# EAGLE design CC2530 (EAGLE 7.1.0)
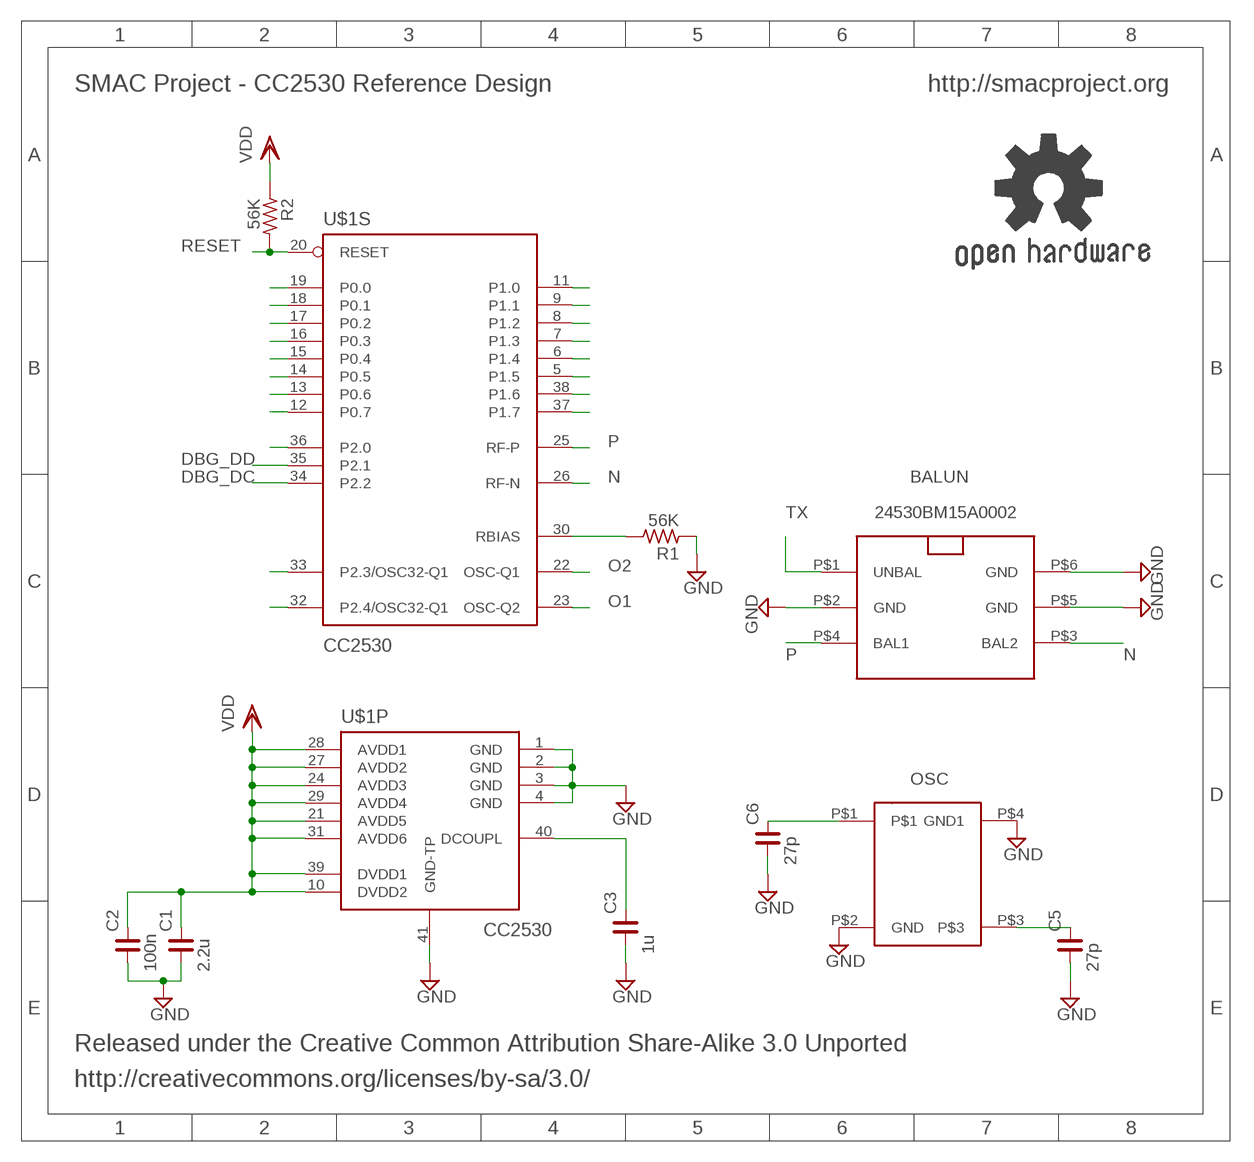
[diagram p0: schematic, sheet 1]

## Parts
C1  2.2u  C_0402  [C0402]
C2  100n  C_0402  [C0402]
C3  1u  C_0402  [C0402]
C5  27p  C_0402  [C0402]
C6  27p  C_0402  [C0402]
GOLD_ORB_SM2  OSHWLOGO_REF_SM  [OSHW2REF]
R1  56K  R_0402  [R0402]
R2  56K  R_0402  [R0402]
U$1  CC2530  [QFN50P600X600X100-41N]
U$2  24530BM15A0002  [24530BM15A0002]
U$3  ABM_10  [ABM_OSC]

## Nets
DBG_DC: U$1.34(P2.2)
DBG_DD: U$1.35(P2.1)
GND: C1.1 C2.1 C3.1 C5.1 C6.1 R1.1 U$1.1(GND) U$1.2(GND) U$1.3(GND) U$1.4(GND) U$1.41(GND-TP) U$2.P$2(GND) U$2.P$5(GND) U$2.P$6(GND) U$3.P$2(GND) U$3.P$4(GND1)
N: U$1.26(RF-N) U$2.P$3(BAL2)
N$1: C3.2 U$1.40(DCOUPL)
N$2: U$1.33(P2.3/OSC32-Q1)
N$3: U$1.11(P1.0)
N$4: U$1.9(P1.1)
N$5: R1.2 U$1.30(RBIAS)
N$6: U$1.37(P1.7)
N$7: U$1.38(P1.6)
N$8: U$1.5(P1.5)
N$9: U$1.8(P1.2)
N$10: U$1.7(P1.3)
N$11: U$1.6(P1.4)
N$12: U$1.13(P0.6)
N$13: U$1.12(P0.7)
N$14: U$1.16(P0.3)
N$15: U$1.17(P0.2)
N$16: U$1.36(P2.0)
N$17: U$1.14(P0.5)
N$18: U$1.15(P0.4)
N$19: U$1.18(P0.1)
N$20: U$1.19(P0.0)
N$21: U$1.32(P2.4/OSC32-Q1)
O1: C6.2 U$1.23(OSC-Q2) U$3.P$1
O2: C5.2 U$1.22(OSC-Q1) U$3.P$3
P: U$1.25(RF-P) U$2.P$4(BAL1)
RESET: R2.2 U$1.20(RESET)
TX: U$2.P$1(UNBAL)
VDD: C1.2 C2.2 R2.1 U$1.10(DVDD2) U$1.21(AVDD5) U$1.24(AVDD3) U$1.27(AVDD2) U$1.28(AVDD1) U$1.29(AVDD4) U$1.31(AVDD6) U$1.39(DVDD1)

## Notes on the sheet
- SMAC Project - CC2530 Reference Design | http://smacproject.org
- BALUN
- OSC
- Released under the Creative Common Attribution Share-Alike 3.0 Unported
- http://creativecommons.org/licenses/by-sa/3.0/

## Library data of the parts
C1-C3 C5 C6 = rc-master-smd:C_: NON-POLARIZED CAP
GOLD_ORB_SM2 = bfl:OSHWLOGO: These are Open-Source Hardware logos.
R1 R2 = rc-master-smd:R_: RESISTOR
U$1 = chipcon-ti-v2:CC2530: A True System-on-Chip Solution for 2.4-GHz IEEE 802.15.4 and ZigBee Applications
U$2 = 24530BM15A0002:24530BM15A0002
U$3 = abm_osc:ABM_10

## Board
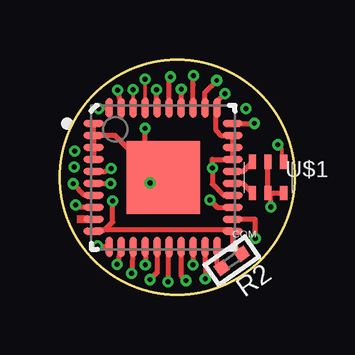
[diagram p1: board, top side]
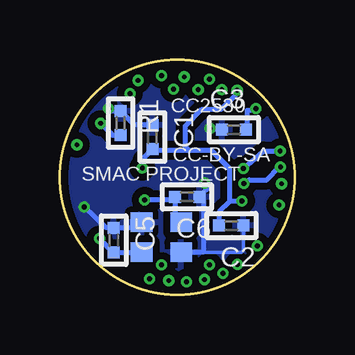
[diagram p2: board, bottom side, seen from below]

Size 9.8 x 9.8 mm. Coordinates in mm from the lower left corner, seen from the top.
Outline: circle at 4.9,4.9 radius 4.9
Copper layers (1*16): Top 0.035mm / dielectric 0.1mm / Bottom 0.035mm
Design rules "default *": minimum track width 0.1mm, minimum drill 0.1mm, track to track 0.16mm, track to pad 0.16mm, pad to pad 0.15mm, via to via 0.15mm, smd to smd 0.15mm, copper to edge 0.1mm, drill to drill 0.1mm, minimum pad ring 0.13mm, minimum via ring 0.13mm, stop-mask expansion 0.015mm, vias tented up to drill 8mil, thermal gap 10mil

### Footprints (pad centres in the part's own frame; a part is rotated, then mirrored left to right if it is on the bottom)
C0402 = smd 0.5 x 0.5: 1 -0.508,0; 2 0.508,0
R0402 = smd 0.5 x 0.5: 1 -0.508,0; 2 0.508,0
QFN50P600X600X100-41N = smd 0.85 x 0.3: 1 -2.9,2.25; 2 -2.9,1.75; 3 -2.9,1.25; 4 -2.9,0.75; 5 -2.9,0.25; 6 -2.9,-0.25; 7 -2.9,-0.75; 8 -2.9,-1.25; 9 -2.9,-1.75; 10 -2.9,-2.25; 21 2.9,-2.25; 22 2.9,-1.75; 23 2.9,-1.25; 24 2.9,-0.75; 25 2.9,-0.25; 26 2.9,0.25; 27 2.9,0.75; 28 2.9,1.25; 29 2.9,1.75; 30 2.9,2.25 | smd 0.3 x 0.85: 11 -2.25,-2.9; 12 -1.75,-2.9; 13 -1.25,-2.9; 14 -0.75,-2.9; 15 -0.25,-2.9; 17 0.75,-2.9; 18 1.25,-2.9; 19 1.75,-2.9; 20 2.25,-2.9; 31 2.25,2.9; 32 1.75,2.9; 33 1.25,2.9; 34 0.75,2.9; 35 0.25,2.9; 36 -0.25,2.9; 38 -1.25,2.9; 39 -1.75,2.9; 40 -2.25,2.9 | smd 0.3 x 0.9: 16 0.25,-2.9; 37 -0.75,2.9 | smd 3.048 x 3.048: 41 0,0
24530BM15A0002 = smd 0.6 x 0.3: P$1 -0.65,0.65; P$2 -0.65,0; P$3 -0.65,-0.65; P$4 0.65,-0.65; P$5 0.65,0; P$6 0.65,0.65
ABM_OSC = smd 0.9 x 0.8: P$1 -0.825,-0.625; P$2 0.825,-0.625; P$3 0.825,0.625; P$4 -0.825,0.625

### Placement (x,y rotation side)
C1  5.94,6.58 270 bottom
C2  2.65,2.89 180 bottom
C3  2.54,6.89 0 bottom
C5  7.55,2.28 270 bottom
C6  4.49,4.09 180 bottom
GOLD_ORB_SM2  12.26,1.51 0 top
R1  7.27,7.16 270 bottom
R2  7.17,1.42 215 top
U$1  4.31,4.9 0 top
U$2  8.68,4.9 270 top
U$3  5.57,2.4 180 bottom

### Tracks (layer width: path | path; a pad name or v marks a point on that pad's centre or on a via)
DBG_DC  (via drill 0.2)
  Top 0.2: U$1.34 v5.06,8.58
DBG_DD  (via drill 0.2)
  Top 0.2: U$1.35 4.56,9.09 v4.61,9.09
GND  (via drill 0.2 pad 0.35)
  Top 0.1: 8.77,4.24 U$2.P$5
  Top 0.2: U$1.2 U$1.1 | U$1.2 U$1.3 U$1.4 arc90 1.18,5.62 | 3.33,5.62 arc-90 U$1.41 v3.76,4.66 | U$2.P$2 U$2.P$5 U$2.P$6 | 3.33,5.62 3.53,5.82 v3.55,6.94 | v8.8,3.67 8.77,4.24 | 3.33,5.62 2.3,6.65 U$1.2
  Bottom 0.15: U$3.P$4 5.09,1.78 | U$3.P$2 arc4 5.98,3 | C2.1 2.14,1.87 2.23,1.78 3.81,1.78 3.82,1.78
  Bottom 0.2: C5.1 6.63,2.79 U$3.P$2 | U$3.P$4 3.82,1.78 3.82,4.09 C6.1 3.69,4.39 v3.76,4.66 3.63,4.46 | C5.1 7.67,2.79 | C5.1 7.86,2.79 v8.8,3.67 | v7.77,7.76 7.63,7.67 R1.1 6.69,7.09 C1.1 5.94,6.94 | C3.1 3.05,6.94 v3.55,6.94
  pour Bottom (isolate 0.3): 0.01,4.37 0.01,4.74 arc-90 5.07,9.8 arc-101 9.72,4.18 arc-79 4.72,0.08 arc-88 0.08,4.52
N
  Top 0.2: U$1.26 7.63,5.15 U$2.P$3
N$1  (via drill 0.2 pad 0.35)
  Top 0.2: U$1.40 1.64,7.8 v1.62,7.78
  Bottom 0.2: C3.2 1.99,6.93 1.99,7.69 1.7,7.69 v1.62,7.78
N$2  (via drill 0.2 pad 0.35)
  Top 0.2: v5.57,9.15 5.56,8.76 U$1.33
N$3  (via drill 0.2)
  Top 0.2: v1.57,2.05 1.61,2 U$1.11
N$5  (via drill 0.2 pad 0.35)
  Top 0.2: U$1.30 v8.1,7.15 v8.11,7.16
  Bottom 0.2: R1.2 7.61,6.66 v8.11,7.16
N$6  (via drill 0.2)
  Top 0.15: U$1.37 v3.56,9
  Top 0.2: U$1.37
N$7  (via drill 0.2)
  Top 0.15: U$1.38 3.06,8.66
  Top 0.2: 3.06,8.66 v3.05,8.56
N$8  (via drill 0.2)
  Top 0.15: U$1.5 1.25,5.08
  Top 0.2: U$1.5 1.9,5.15 v2.14,5.27
  Bottom 0.2: v2.14,5.27 1.31,6 v0.61,6
N$9  (via drill 0.2)
  Top 0.15: U$1.8 arc90 1.19,3.69 1.02,3.65 arc-92 1.11,3.65
  Top 0.2: v0.65,3.75 0.56,3.65 U$1.8
N$10  (via drill 0.2)
  Top 0.2: v0.55,4.63 1.04,4.15 U$1.7
N$11  (via drill 0.2)
  Top 0.2: U$1.6 1.98,4.65 v2.12,4.64
  Bottom 0.2: v2.12,4.64 1.9,4.8 1.17,4.8 0.64,5.33 v0.59,5.33
N$12  (via drill 0.2)
  Top 0.2: U$1.13 v3,0.89
N$13  (via drill 0.2)
  Top 0.2: U$1.12 v2.39,1.27
N$14  (via drill 0.2)
  Top 0.2: v4.51,0.55 4.51,1.95 U$1.16
N$15  (via drill 0.2)
  Top 0.2: U$1.17 5.06,0.79 v5.26,0.59
N$16  (via drill 0.2)
  Top 0.2: U$1.36 4.09,7.8 4.03,7.86 v4.03,8.56
N$17  (via drill 0.2)
  Top 0.2: U$1.14 v3.56,1.24
N$18  (via drill 0.2)
  Top 0.2: U$1.15 4.06,0.93 v3.76,0.64
N$19  (via drill 0.2)
  Top 0.2: U$1.18 v5.56,1.24
N$20  (via drill 0.2)
  Top 0.2: U$1.19 v6.06,0.66
N$21  (via drill 0.2 pad 0.35)
  Top 0.2: U$1.32 6.06,8.46 v6.54,8.94
O1  (via drill 0.2 pad 0.35)
  Top 0.2: U$1.23 6.57,3.65 v6.26,3.96
  Bottom 0.2: U$3.P$1 5,3.03 C6.2 5.13,3.96 v6.26,3.96
O2  (via drill 0.2 pad 0.35)
  Top 0.2: U$1.22 8.15,3.15 v8.15,2.35
  Bottom 0.2: U$3.P$3 C5.2 | C5.2 arc-90 7.6,1.82 | C5.2 7.57,1.79 | v8.15,2.35 7.57,1.77 C5.2
P
  Top 0.2: 6.96,4.66 U$1.25 7.63,4.65 U$2.P$4
RESET
  Top 0.2: U$1.20 6.56,1.32 R2.2
TX  (via drill 0.2 pad 0.35)
  Top 0.15: U$2.P$1 9.26,5.62 9.26,6.1 v9.09,6.26
VDD  (via drill 0.2, 0.2 pad 0.35)
  Top 0.2: U$1.28 6.93,6.13 6.95,6.13 | U$1.29 6.95,6.63 | U$1.27 arc-90 6.95,5.65 U$1.27 | U$1.29 6.93,6.63 6.75,6.63 6.51,6.86 6.51,7.75 U$1.31 6.56,8.08 v6.88,8.4 | v2.21,3.92 2.21,3.04 1.87,2.71 1.15,2.71 U$1.10 1.47,2.71 7.15,2.71 U$1.21 | U$1.21 6.88,2.65 | U$1.28 U$1.29 | U$1.27 U$1.28 | U$1.24 6.83,4.15 6.36,4.62 v6.36,5.28 v6.36,5.29 6.36,5.65 U$1.27 | v2.4,8.54 U$1.39 | U$1.21 7.21,2.09 R2.1
  Bottom 0.2: C1.2 | C1.2 arc-90 5.96,6.05 6.36,5.65 v6.36,5.29 | 2.71,3.9 2.71,5.24 3.48,6.01 4.42,6.01 | v2.21,3.92 2.22,3.9 2.71,3.9 | 2.71,3.9 3.15,3.46 C2.2 | C1.2 5.88,6.01 4.42,6.01 | v2.4,8.54 2.42,8.39 3.08,7.74 3.87,7.74 4.56,7.04 4.56,6.16 4.42,6.01
(copper drawn outside any net)
  shapes: Top area x1

### Text on the board
tPlace: COM
bPlace: CC2530 | CC-BY-SA | SMAC PROJECT
Reference: http://smacproject.org